# Altium schematic sheet CON_DACx4_KMRJIO3_5MM_6WAY.SchDoc: Screw Header For DAC
size A4; Organization: Altium Limited.; Address1: Level 3, 12a Rodborough Rd; Address2: Frenchs Forest 2086; Address3: NSW; Address4: AUSTRALIA; DocumentNumber: 12; SheetNumber: 13; SheetTotal: 77
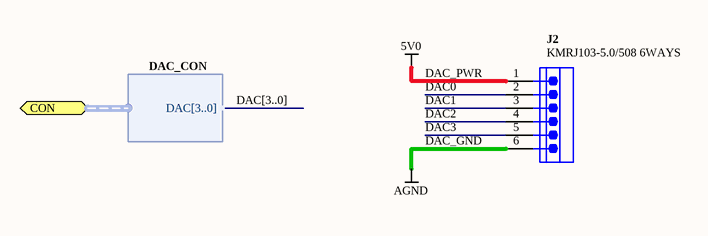
[diagram p0: CON_DACx4_KMRJIO3_5MM_6WAY.SchDoc]

## Parts
J2  KMRJ103-5.0/508 6WAYS  [KMRJ103-5-508-6]

## Ports
CON (harness DAC_CON)

## Harnesses
DAC_CON: DAC[3..0]

## Nets
DAC_GND: J2.6  [also labelled AGND]
DAC_PWR: J2.1  [also labelled 5V0]
DAC0: J2.2
DAC1: J2.3
DAC2: J2.4
DAC3: J2.5

## Buses and harness runs
bus DAC[3..0]

## Notes on the sheet
- Sheet Title
- Project Title
- Size:
- Date:
- A4
- Assy:
- Time:
- Revision:
- Sheet
- of
- File:

## Library data of the parts
J2 = D-300-0122: Socket, Screw Terminal Block, 6 Way, 5.0mm pitch, 45 degree angle, Through-hole; Connector type: Header; Max Current: 300V/10A A; Mounting Technology: Through-Hole; Pin Count: 6; Status: Unreleased; Category: Connector